# EAGLE design LED Array (EAGLE 9.5.1)
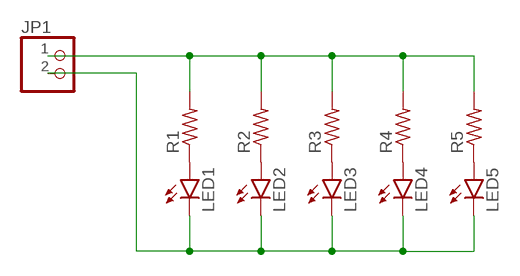
[diagram p0: schematic, sheet 1]

## Parts
JP1  PINHD-1X2  [1X02]
LED1  LED3MM  [LED3MM]
LED2  LED3MM  [LED3MM]
LED3  LED3MM  [LED3MM]
LED4  LED3MM  [LED3MM]
LED5  LED3MM  [LED3MM]
R1  R-US_0207/12  [0207/12]
R2  R-US_0207/12  [0207/12]
R3  R-US_0207/12  [0207/12]
R4  R-US_0207/12  [0207/12]
R5  R-US_0207/12  [0207/12]

## Nets
N$1: LED1.A R1.1
N$2: LED3.A R3.1
N$3: LED2.A R2.1
N$4: LED4.A R4.1
N$5: JP1.2 LED1.K(C) LED2.K(C) LED3.K(C) LED4.K(C) LED5.K(C)
N$6: JP1.1 R1.2 R2.2 R3.2 R4.2 R5.2
N$7: LED5.A R5.1

## Library data of the parts
JP1 = pinhead:PINHD-1X2: PIN HEADER
LED1-LED5 = led:LED: LED OSRAM: - CHIPLED LG R971, LG N971, LY N971, LG Q971, LY Q971, LO R971, LY R971 LH N974, LH R974 LS Q976, LO Q976, LY Q976 LO Q996 - Hyper CHIPLED LW Q18S LB Q993, LB Q99A, LB R99A - SideLED LS A670, LO A670, LY A670, LG A670, LP A670 LB A673, LV A673, LT A673, LW A673 LH A674 LY A675 LS A676, LA A676, LO A676, LY A676, LW A676 LS A679, LY A679, LG A679 - Hyper Micro SIDELED® LS Y876, LA Y876, LO Y876, LY Y876 LT Y87S - SmartLED LW L88C, LW L88S LB L89C, LB L89S, LG L890 LS L89K, LO L89K, LY L89K LS L896, LA L896, LO L896, LY L896 - TOPLED LS T670, LO T670, LY T670, LG T670, LP T670 LSG T670, LSP T670, LSY T670, LOP T670, LYG T670 LG T671, LOG T671, LSG T671 LB T673, LV T673, LT T673, LW T673 LH T674 LS T676, LA T676, LO T676, LY T676, LB T676, LH T676, LSB T676, LW T676 LB T67C, LV T67C, LT T67C, LS T67K, LO T67K, LY T67K, LW E67C LS E67B, LA E67B, LO E67B, LY E67B, LB E67C, LV E67C, LT E67C LW T67C LS T679, LY T679, LG T679 LS T770, LO T770, LY T770, LG T770, LP T770 LB T773, LV T773, LT T773, LW T773 LH T774 LS E675, LA E675, LY E675, LS T675 LS T776, LA T776, LO T776, LY T776, LB T776 LHGB T686 LT T68C, LB T68C - Hyper Mini TOPLED® LB M676 - Mini TOPLED Santana® LG M470 LS M47K, LO M47K, LY M47K Source: http://www.osram.convergy.de LUXEON: - LUMILED® LXK2-PW12-R00, LXK2-PW12-S00, LXK2-PW14-U00, LXK2-PW14-V00 LXK2-PM12-R00, LXK2-PM12-S00, LXK2-PM14-U00 LXK2-PE12-Q00, LXK2-PE12-R00, LXK2-PE12-S00, LXK2-PE14-T00, LXK2-PE14-U00 LXK2-PB12-K00, LXK2-PB12-L00, LXK2-PB12-M00, LXK2-PB14-N00, LXK2-PB14-P00, LXK2-PB14-Q00 LXK2-PR12-L00, LXK2-PR12-M00, LXK2-PR14-Q00, LXK2-PR14-R00 LXK2-PD12-Q00, LXK2-PD12-R00, LXK2-PD12-S00 LXK2-PH12-R00, LXK2-PH12-S00 LXK2-PL12-P00, LXK2-PL12-Q00, LXK2-PL12-R00 Source: www.luxeon.com KINGBRIGHT: KA-3528ASYC Source: www.kingbright.com
R1-R5 = rcl:R-US_: RESISTOR, American symbol; SPICEPREFIX: R

## Board
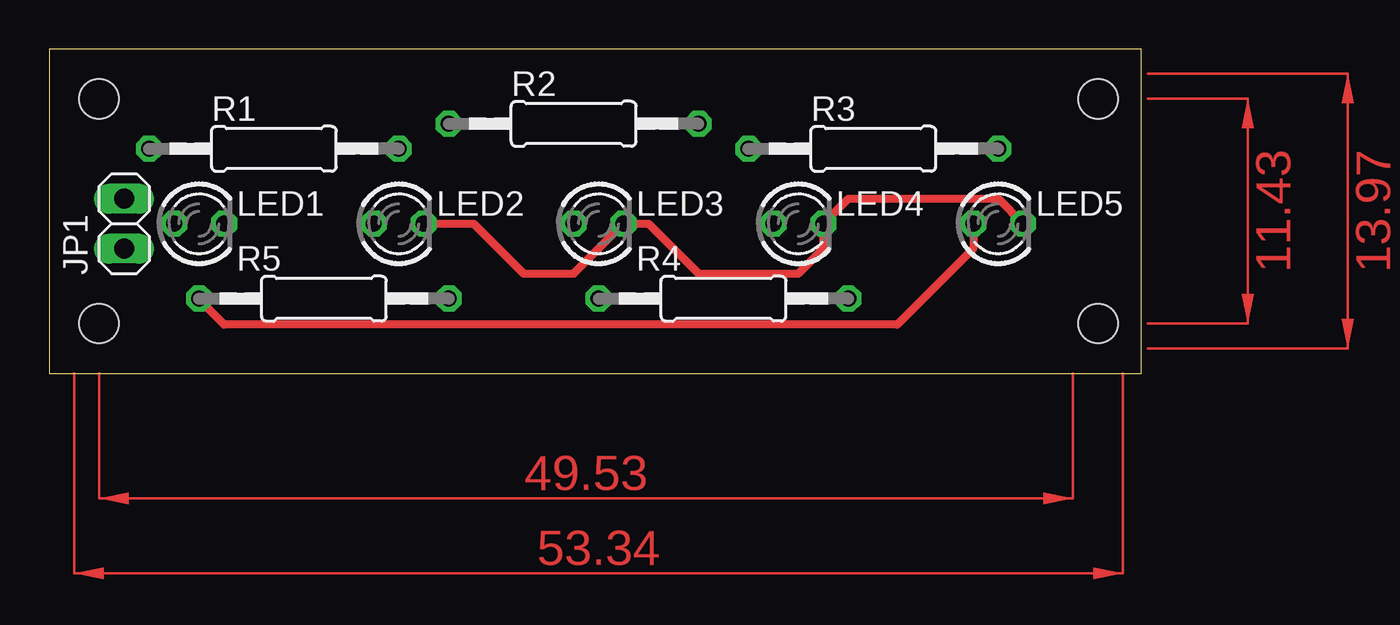
[diagram p1: board, top side]
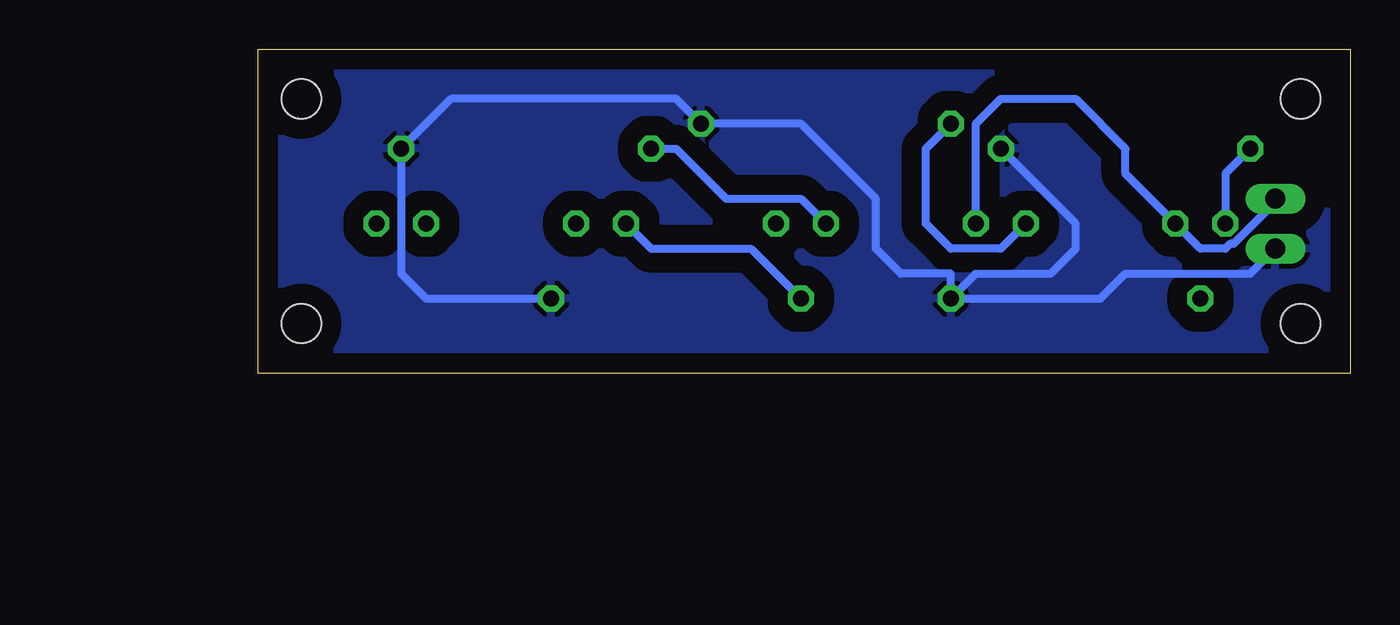
[diagram p2: board, bottom side, seen from below]

Size 55.55 x 16.5 mm. Coordinates in mm from the lower left corner, seen from the top.
Outline: 0,0 55.55,0 55.55,16.5 0,16.5 0,0
Copper layers (1*16): Top 0.035mm / dielectric 1.5mm / Bottom 0.035mm
Design rules "default": minimum track width 6mil, minimum drill 0.35mm, track to track 6mil, track to pad 6mil, pad to pad 6mil, via to via 6mil, smd to smd 6mil, copper to edge 40mil, drill to drill 6mil, minimum pad ring 10mil, minimum via ring 8mil, stop-mask expansion 4mil, vias tented up to drill 0mil, thermal gap 10mil
Holes 2 mm at 2.54,13.97 53.34,13.97 53.34,2.54 2.54,2.54

### Footprints (pad centres in the part's own frame; a part is rotated, then mirrored left to right if it is on the bottom)
1X02 = drill 1.016 long: 1 -1.27,0; 2 1.27,0
LED3MM = drill 0.813 octagon: A -1.27,0; K 1.27,0
0207/12 = drill 0.813 octagon: 1 -6.35,0; 2 6.35,0

### Placement (x,y rotation side)
JP1  3.81,7.62 90 top
LED1  7.62,7.62 0 top
LED2  17.78,7.62 0 top
LED3  27.94,7.62 0 top
LED4  38.1,7.62 0 top
LED5  48.26,7.62 0 top
R1  11.43,11.43 0 top
R2  26.67,12.7 0 top
R3  41.91,11.43 0 top
R4  34.29,3.81 0 top
R5  13.97,3.81 0 top

### Tracks (layer width: path | path; a pad name or v marks a point on that pad's centre or on a via)
N$1
  Bottom 0.406: R1.1 6.35,10.16 LED1.A
N$2
  Bottom 0.406: R3.1 34.29,11.43 31.75,8.89 27.94,8.89 LED3.A
N$3
  Bottom 0.406: LED2.A 17.78,6.35 20.32,6.35 21.59,7.62 21.59,11.43 R2.1
N$4
  Bottom 0.406: LED4.A 35.56,6.35 30.48,6.35 R4.1
N$5
  Top 0.406: LED2.K 21.59,7.62 24.13,5.08 26.67,5.08 LED3.K 30.48,7.62 33.02,5.08 38.1,5.08 39.37,6.35 LED4.K 40.64,8.89 48.26,8.89 LED5.K
  Bottom 0.406: JP1.2 3.81,8.72 5.93,6.6 6.1,6.6 6.35,6.35 7.62,6.35 LED1.K 11.43,10.16 11.43,11.43 13.97,13.97 17.78,13.97 19.05,12.7 LED2.K
N$6
  Bottom 0.406: JP1.1 5.08,5.08 11.43,5.08 12.7,3.81 R5.2 | R5.2 20.32,5.08 22.86,5.08 24.13,6.35 24.13,8.89 27.94,12.7 R2.2 34.29,13.97 45.72,13.97 R3.2 48.26,5.08 46.99,3.81 R4.2 | R5.2 16.51,3.81 | R1.2 13.97,7.62 13.97,6.35 15.24,5.08 19.05,5.08 R5.2
  pour Bottom (isolate 1.016): 0,16.51 55.88,16.51 55.88,0 0,0
N$7
  Top 0.406: LED5.A 46.99,6.35 43.13,2.49 8.89,2.49 7.62,3.76 R5.1
(copper drawn outside any net)
  shapes: Top area x4